# Altium schematic sheet Sheet1.SchDoc
size A; SheetNumber: 1; SheetTotal: 1
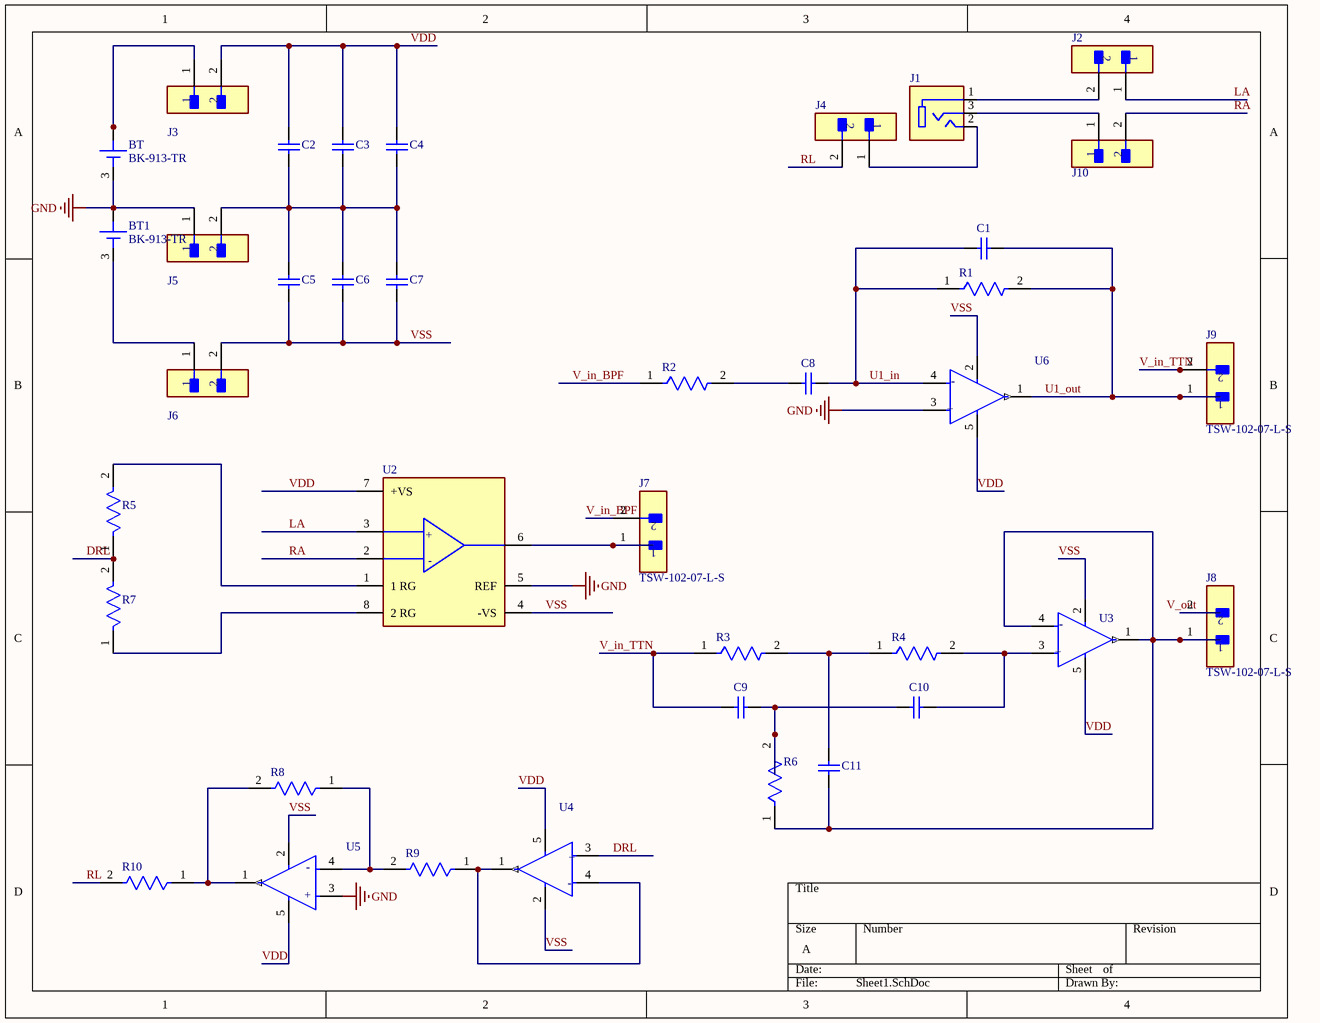
[diagram p0: Sheet1.SchDoc]

## Parts
BT  BK-913-TR  [BAT_BK-913-TR]
BT1  BK-913-TR  [BAT_BK-913-TR]
C1  C0805C225K9PACTU  [CAPC2013X145X50ML20T25]  (value not drawn)
C2  C0805C225K9PACTU  [CAPC2013X145X50ML20T25]  (value not drawn)
C3  C0805C225K9PACTU  [CAPC2013X145X50ML20T25]  (value not drawn)
C4  C0805C225K9PACTU  [CAPC2013X145X50ML20T25]  (value not drawn)
C5  C0805C225K9PACTU  [CAPC2013X145X50ML20T25]  (value not drawn)
C6  C0805C225K9PACTU  [CAPC2013X145X50ML20T25]  (value not drawn)
C7  C0805C225K9PACTU  [CAPC2013X145X50ML20T25]  (value not drawn)
C8  C0805C225K9PACTU  [CAPC2013X145X50ML20T25]  (value not drawn)
C9  C0805C225K9PACTU  [CAPC2013X145X50ML20T25]  (value not drawn)
C10  C0805C225K9PACTU  [CAPC2013X145X50ML20T25]  (value not drawn)
C11  C0805C225K9PACTU  [CAPC2013X145X50ML20T25]  (value not drawn)
J1  SJ-3523-SMT-TR  [CUI_SJ-3523-SMT-TR]  (value not drawn)
J2  TSW-102-07-L-S  [FP-TSW-102-07-L-S-MFG]  (value not drawn)
J3  TSW-102-07-L-S  [FP-TSW-102-07-L-S-MFG]  (value not drawn)
J4  TSW-102-07-L-S  [FP-TSW-102-07-L-S-MFG]  (value not drawn)
J5  TSW-102-07-L-S  [FP-TSW-102-07-L-S-MFG]  (value not drawn)
J6  TSW-102-07-L-S  [FP-TSW-102-07-L-S-MFG]  (value not drawn)
J7  TSW-102-07-L-S  [FP-TSW-102-07-L-S-MFG]
J8  TSW-102-07-L-S  [FP-TSW-102-07-L-S-MFG]
J9  TSW-102-07-L-S  [FP-TSW-102-07-L-S-MFG]
J10  TSW-102-07-L-S  [FP-TSW-102-07-L-S-MFG]  (value not drawn)
R1  CRCW080516K0FKEA  [FP-CRCW0805-e3-IPC_C]  (value not drawn)
R2  CRCW080516K0FKEA  [FP-CRCW0805-e3-IPC_C]  (value not drawn)
R3  CRCW080516K0FKEA  [FP-CRCW0805-e3-IPC_C]  (value not drawn)
R4  CRCW080516K0FKEA  [FP-CRCW0805-e3-IPC_C]  (value not drawn)
R5  CRCW080516K0FKEA  [FP-CRCW0805-e3-IPC_C]  (value not drawn)
R6  CRCW080516K0FKEA  [FP-CRCW0805-e3-IPC_C]  (value not drawn)
R7  CRCW080516K0FKEA  [FP-CRCW0805-e3-IPC_C]  (value not drawn)
R8  CRCW080516K0FKEA  [FP-CRCW0805-e3-IPC_C]  (value not drawn)
R9  CRCW080516K0FKEA  [FP-CRCW0805-e3-IPC_C]  (value not drawn)
R10  CRCW080516K0FKEA  [FP-CRCW0805-e3-IPC_C]  (value not drawn)
U2  AD620ARZ-REEL7  [FP-R-8-IPC_B]  (value not drawn)
U3  TLV521DCKT  [FP-DCK0005A-MFG]  (value not drawn)
U4  TLV521DCKT  [FP-DCK0005A-MFG]  (value not drawn)
U5  TLV521DCKT  [FP-DCK0005A-MFG]  (value not drawn)
U6  TLV521DCKT  [FP-DCK0005A-MFG]  (value not drawn)

## Nets
GND: BT.3(NEG) BT1.1(POS) BT1.2(POS) J5.1 U2.5(REF) U5.3(IN+) U6.3(IN+)
DRL: R5.1 R7.2 U4.3(IN+)
LA: J2.1 U2.3(+IN)
RA: J10.2 U2.2(-IN)
RL: J4.2 R10.2
U1_in: C1.2 C8.1 R1.1 U6.4(IN-)
U1_out: C1.1 J9.1 R1.2 U6.1(OUT)
V_in_BPF: J7.2 R2.1
V_in_TTN: C9.2 J9.2 R3.1
VDD: C2.2 C3.2 C4.2 J3.2 U2.7(+VS) U3.5(V+) U4.5(V+) U5.5(V+) U6.5(V+)
VSS: C5.1 C6.1 C7.1 J6.2 U2.4(-VS) U3.2(V-) U4.2(V-) U5.2(V-) U6.2(V-)
NetBT1_3: BT1.3(NEG) J6.1
NetBT_1: BT.1(POS) BT.2(POS) J3.1
NetC2_1: C2.1 C3.1 C4.1 C5.2 C6.2 C7.2 J5.2
NetC8_2: C8.2 R2.2
NetC9_1: C9.1 C10.2 R6.2
NetC10_1: C10.1 R4.2 U3.3(IN+)
NetC11_1: C11.1 R3.2 R4.1
NetC11_2: C11.2 J8.1 R6.1 U3.1(OUT) U3.4(IN-)
NetJ1_1: J1.1 J2.2
NetJ1_2: J1.2 J4.1
NetJ1_3: J1.3 J10.1
NetJ7_1: J7.1 U2.6(OUTPUT)
NetR5_2: R5.2 U2.1(1_RG)
NetR7_1: R7.1 U2.8(2_RG)
NetR8_1: R8.1 R9.2 U5.4(IN-)
NetR8_2: R8.2 R10.1 U5.1(OUT)
NetR9_1: R9.1 U4.1(OUT) U4.4(IN-)

Not connected (* = marked no-connect by the designer): J8 2

## Notes on the sheet
- Labels drawn without touching a wire or pin: V_out
- (in symbol CMP-04895-000072-1) -; +
- (in symbol CMP-09116-000354-1) +

## Library data of the parts
BT BT1 = BK-913-TR: Battery Retainer Coin, 20.0mm 1 Cell PC Pin; MF: MPD (Memory; MP: BK-913-TR; Package: MSOP-12 MPD; SnapEDA_Link: https://www.snapeda.com/parts/BK-913-TR/MPD%20(Memory%20Protection%20Devices)/view-part/576523/?ref=snap; Value: *; Digi-Key_Part_Number: BK-913-CT-ND
C1-C11 = CMP-1036-04819-2: Manufacturer: Kemet; Part Number: C0805C225K9PACTU
J1 = SJ-3523-SMT-TR: <b>Audio Jack Connector</b> 3.5 mm Low Profile Surface Mount Stereo Jack, 3 Pin Right-Angle; Package: None; MP: SJ-3523-SMT-TR; Value: *; Availability: Unavailable; Price: None
J2-J10 = CMP-02766-001428-1: CONN HEADER VERT 2POS 2.54MM; Voltage Rating: 550V; Current Rating: 7.6A; Gender: Male; Number of Contacts: 2; Connector Type: Male Pin; Radiation Hardening: No; Orientation: Straight; Contact Plating: Gold; Max Operating Temperature: 125°C; Mount: Through Hole; Package Quantity: 1; Number of Rows: 1; Housing Material: Polyester; RoHS Compliant: Yes; Length: 5.08mm; Max Voltage Rating (AC): 550V; Pitch: 2.54mm; Packaging: Bulk; Depth: 2.54mm; Termination: Solder; Min Operating Temperature: -55°C; Housing Color: Black; Lead Free: Lead Free; Color: Black; Number of Positions: 2; Width: 2.54mm; Max Current Rating: 7.6A; REACH SVHC: No SVHC; Contact Material: Bronze; Contact Mating Length: 0.23inch; Series: TSW; Contact Type: Male Pin
R1-R10 = CMP-2001-04979-2: RES Thick Film, 16kΩ, 1%, 0.125W, 100ppm/°C, 0805; Voltage Rating: 150V; Power Rating: 125mW; Resistance: 16kR; Contact Plating: Tin; Case Code (Imperial): 0805; Tolerance: 1%; Weight: 0.000194oz; Height: 0.45mm; Max Power Dissipation: 125mW; Lead Free: Lead Free; Number of Pins: 2; Composition: Thick Film; Package Quantity: 10; Max Operating Temperature: 155°C; Length: 2mm; Width: 1.25mm; Voltage Rating (DC): 150V; Packaging: Tape and Reel; Termination: SMD/SMT; Depth: 1.25mm; Mount: Surface Mount; Temperature Coefficient: 100ppm/°C; Features: Automotive AEC-Q200; Military Standard: Not; Case Code (Metric): 2012; Radiation Hardening: No; Number of Terminations: 2; Min Operating Temperature: -55°C; Case/Package: 0805
U2 = CMP-09116-000354-1: IC INST AMP 1 CIRCUIT 8SOIC; Input Resistance: 10GR; Bandwidth: 800kHz; Dual Supply Voltage: 15V; Number of Channels: 1; Power Dissipation: 650mW; Input Bias Current: 500pA; Common Mode Rejection Ratio: 93dB; Slew Rate: 1.2V/µs; Supply Current: 900uA; Input Offset Voltage (Vos): 30mV; Min Dual Supply Voltage: 2.3V; Min Supply Voltage: 4.6V; Power Supply Rejection Ratio (PSRR): 140dB; Operating Supply Voltage: 18V; Output Current per Channel: 18mA; -3db Bandwidth: 1MHz; Operating Supply Current: 1.3mA; Mount: Surface Mount; RoHS Compliant: Yes; Max Operating Temperature: 125°C; Radiation Hardening: No; Packaging: Tape and Reel; Nominal Supply Current: 900uA; Contact Plating: Tin; Number of Elements: 1; Number of Circuits: 1; Series: -; Case/Package: SOIC; Package Quantity: 1; Max Dual Supply Voltage: 18V; Min Operating Temperature: -55°C; Lead Free: Contains Lead; Number of Pins: 8; Max Power Dissipation: 650mW
U3-U6 = CMP-04895-000072-1: IC CMOS 1 CIRCUIT SC70-5; Input Offset Voltage (Vos): 100uV; Output Current per Channel: 12mA; Number of Circuits: 1; Slew Rate: 2.5V/µs; Operating Supply Current: 350nA; Bandwidth: 6kHz; Input Bias Current: 1pA; Mount: Surface Mount; Case/Package: SC; REACH SVHC: No SVHC; Max Operating Temperature: 125°C; Lead Free: Lead Free; Packaging: Cut Tape; Min Operating Temperature: -40°C; Number of Amplifiers: 1; Gain Bandwidth Product: 6kHz; Number of Pins: 5; Number of Channels: 1